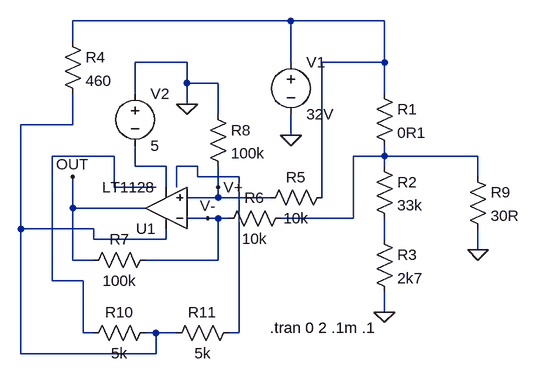
[diagram p0: schematic CC.asc]
CC.asc, the LTspice schematic file:
Version 4
SHEET 1 1012 680
WIRE 64 -32 -272 -32
WIRE 208 -32 64 -32
WIRE -272 0 -272 -32
WIRE -96 32 -176 32
WIRE 64 32 64 -32
WIRE 208 32 208 -32
WIRE 208 32 112 32
WIRE -96 64 -96 32
WIRE -48 64 -96 64
WIRE -176 80 -176 32
WIRE 208 80 208 32
WIRE -96 96 -96 64
WIRE -48 112 -48 64
WIRE -272 128 -272 80
WIRE -272 128 -352 128
WIRE 64 144 64 112
WIRE -208 176 -304 176
WIRE 208 176 208 160
WIRE 208 176 160 176
WIRE 352 176 208 176
WIRE -176 192 -176 160
WIRE -128 192 -176 192
WIRE -80 192 -112 192
WIRE 208 192 208 176
WIRE -80 208 -80 192
WIRE -16 208 -80 208
WIRE 352 208 352 176
WIRE -208 224 -208 176
WIRE -144 224 -208 224
WIRE -128 224 -128 192
WIRE -112 224 -112 192
WIRE -48 224 -48 192
WIRE -48 240 -48 224
WIRE -48 240 -96 240
WIRE 32 240 -48 240
WIRE 112 240 112 32
WIRE -272 256 -272 208
WIRE -160 256 -272 256
WIRE -64 272 -96 272
WIRE -48 272 -64 272
WIRE -32 272 -48 272
WIRE 160 272 160 176
WIRE 160 272 48 272
WIRE -352 288 -352 128
WIRE -240 288 -352 288
WIRE -240 304 -240 288
WIRE -128 304 -128 288
WIRE -128 304 -240 304
WIRE 208 304 208 272
WIRE 352 320 352 288
WIRE -272 336 -272 256
WIRE -240 336 -272 336
WIRE -48 336 -48 272
WIRE -48 336 -160 336
WIRE -304 368 -304 176
WIRE -256 368 -304 368
WIRE 208 416 208 384
WIRE -256 448 -256 368
WIRE -240 448 -256 448
WIRE -144 448 -160 448
WIRE -112 448 -144 448
WIRE -16 448 -16 208
WIRE -16 448 -32 448
WIRE -352 480 -352 288
WIRE -144 480 -144 448
WIRE -144 480 -352 480
FLAG 208 416 0
FLAG 64 144 0
FLAG -96 96 0
FLAG -48 224 V+
FLAG -64 272 V-
FLAG 352 320 0
FLAG -272 208 OUT
SYMBOL res 192 64 R0
SYMATTR InstName R1
SYMATTR Value 0R1
SYMBOL res 192 176 R0
SYMATTR InstName R2
SYMATTR Value 33k
SYMBOL res 192 288 R0
SYMATTR InstName R3
SYMATTR Value 2k7
SYMBOL voltage 64 16 R0
WINDOW 123 0 0 Left 0
WINDOW 39 0 0 Left 0
SYMATTR InstName V1
SYMATTR Value 32V
SYMBOL res -288 -16 R0
SYMATTR InstName R4
SYMATTR Value 460
SYMBOL res 128 224 R90
WINDOW 0 0 56 VBottom 0
WINDOW 3 32 56 VTop 0
SYMATTR InstName R5
SYMATTR Value 10k
SYMBOL res 64 256 R90
WINDOW 0 0 56 VBottom 0
WINDOW 3 32 56 VTop 0
SYMATTR InstName R6
SYMATTR Value 10k
SYMBOL res -144 320 R90
WINDOW 0 0 56 VBottom 0
WINDOW 3 32 56 VTop 0
SYMATTR InstName R7
SYMATTR Value 100k
SYMBOL res -64 96 R0
SYMATTR InstName R8
SYMATTR Value 100k
SYMBOL voltage -176 64 R0
WINDOW 123 0 0 Left 0
WINDOW 39 0 0 Left 0
SYMATTR InstName V2
SYMATTR Value 5
SYMBOL res 336 192 R0
SYMATTR InstName R9
SYMATTR Value 30R
SYMBOL res -144 432 R90
WINDOW 0 0 56 VBottom 0
WINDOW 3 32 56 VTop 0
SYMATTR InstName R10
SYMATTR Value 5k
SYMBOL res -16 432 R90
WINDOW 0 0 56 VBottom 0
WINDOW 3 32 56 VTop 0
SYMATTR InstName R11
SYMATTR Value 5k
SYMBOL Opamps\\LT1128 -128 320 R180
SYMATTR InstName U1
TEXT 32 440 Left 0 !.tran 0 2 .1m .1

The netlist it stands for:
* CC.asc
R1 N001 N004 0R1
R2 N004 N007 33k
R3 N007 0 2k7
V1 N001 0 32V
R4 N001 N002 460
R5 N001 V+ 10k
R6 N004 V- 10k
R7 V- OUT 100k
R8 0 V+ 100k
V2 0 N005 5
R9 N004 0 30R
R10 N002 N003 5k
R11 N006 N002 5k
XU1 V+ V- N002 N005 OUT LT1128  ; pins In+ In- V+ V- OUT
.tran 0 2 .1m .1
.lib LTC.lib
.backanno
.end